# Altium project FMC-320U-A2.PrjPcb
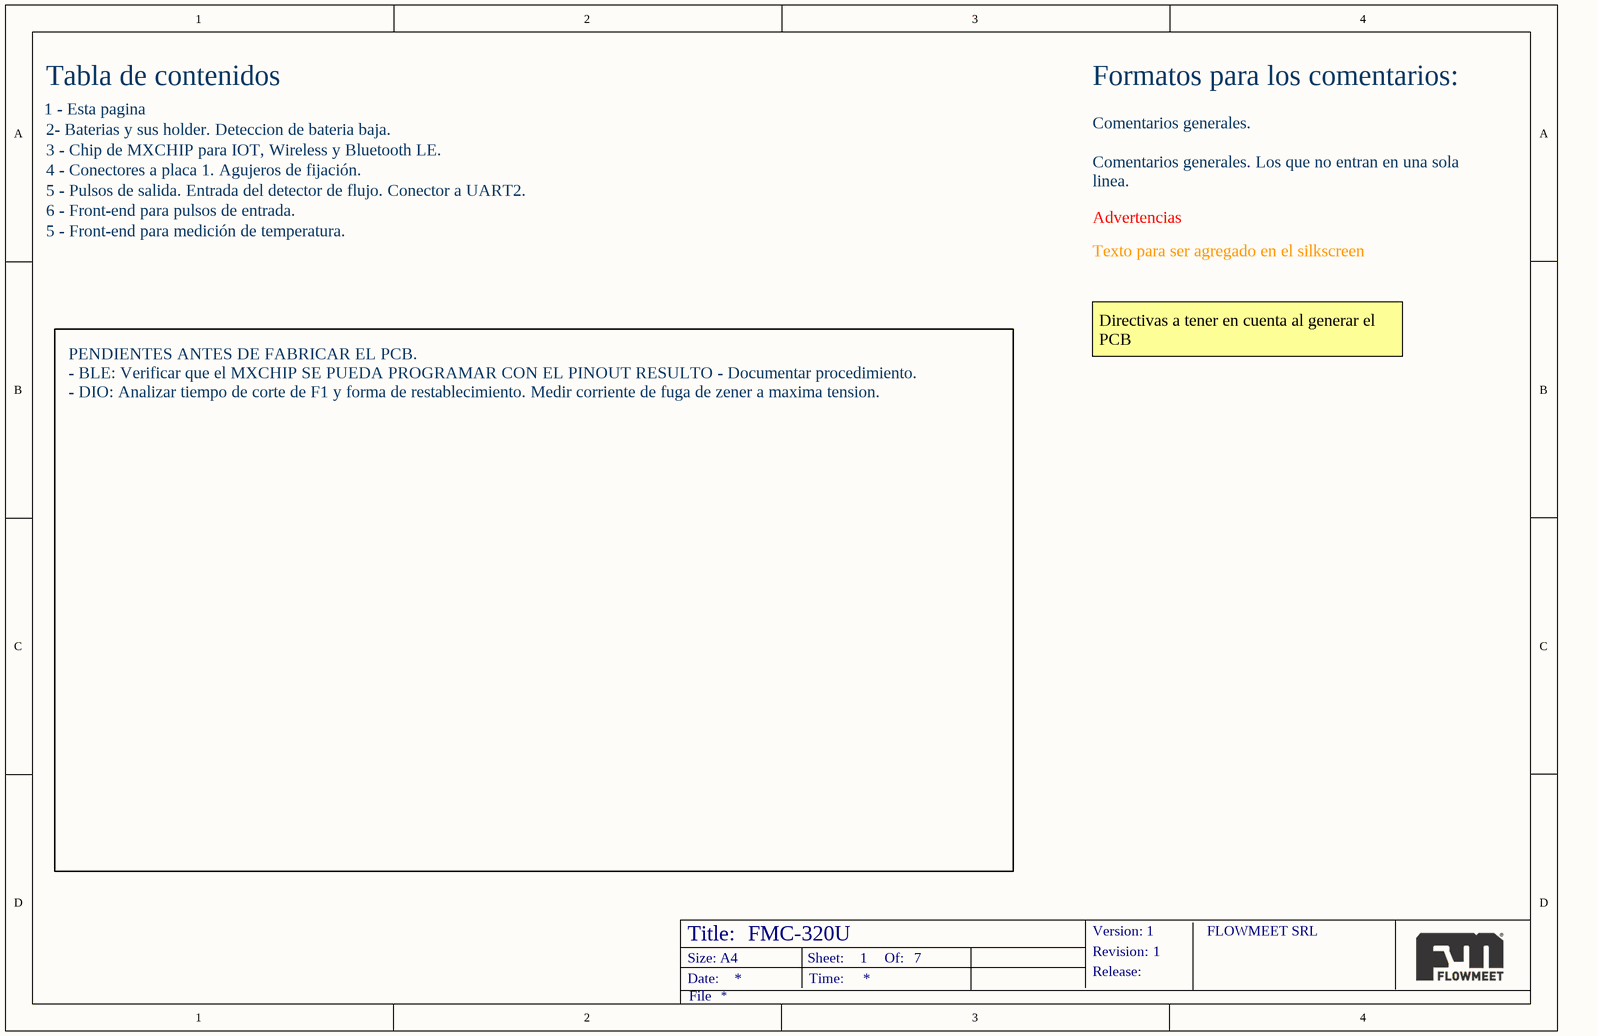
[diagram p0: READ_2.SchDoc]
7 sheets, 84 parts. Net scope: flat (ports and power ports of the same name join across sheets).
Board file: FMC-320U-A2.PcbDoc
Sheets:
  READ_2.SchDoc
  BATTERY.SchDoc
  BLE.SchDoc
  CON2.SchDoc
  DIO.SchDoc
  PULSE.SchDoc
  RTD.SchDoc

## Sheet READ_2.SchDoc: FMC-320U
size A4; Author: DHS; SheetNumber: 1; SheetTotal: 7; thisVersion: 1; ThisRevision: 1; Release: 1

### Notes on the sheet
- 1 - Esta pagina
- Tabla de contenidos
- Formatos para los comentarios:
- 2- Baterias y sus holder. Deteccion de bateria baja.
- 3 - Chip de MXCHIP para IOT, Wireless y Bluetooth LE.
- 4 - Conectores a placa 1. Agujeros de fijación.
- Comentarios generales.
- 5 - Pulsos de salida. Entrada del detector de flujo. Conector a UART2.
- 6 - Front-end para pulsos de entrada.
- 5 - Front-end para medición de temperatura.
- Advertencias
- Comentarios generales. Los que no entran en una sola linea.
- Texto para ser agregado en el silkscreen
- Directivas a tener en cuenta al generar el PCB
- PENDIENTES ANTES DE FABRICAR EL PCB.
  - BLE: Verificar que el MXCHIP SE PUEDA PROGRAMAR CON EL PINOUT RESULTO - Documentar procedimiento.
  - DIO: Analizar tiempo de corte de F1 y forma de restablecimiento. Medir corriente de fuga de zener a maxima tension.
- Title:
- Size: A4
- Date:
- Sheet:
- Time:
- Of:
- Version:
- Revision:
- Release:
- FLOWMEET SRL
- File

## Sheet BATTERY.SchDoc
size A4
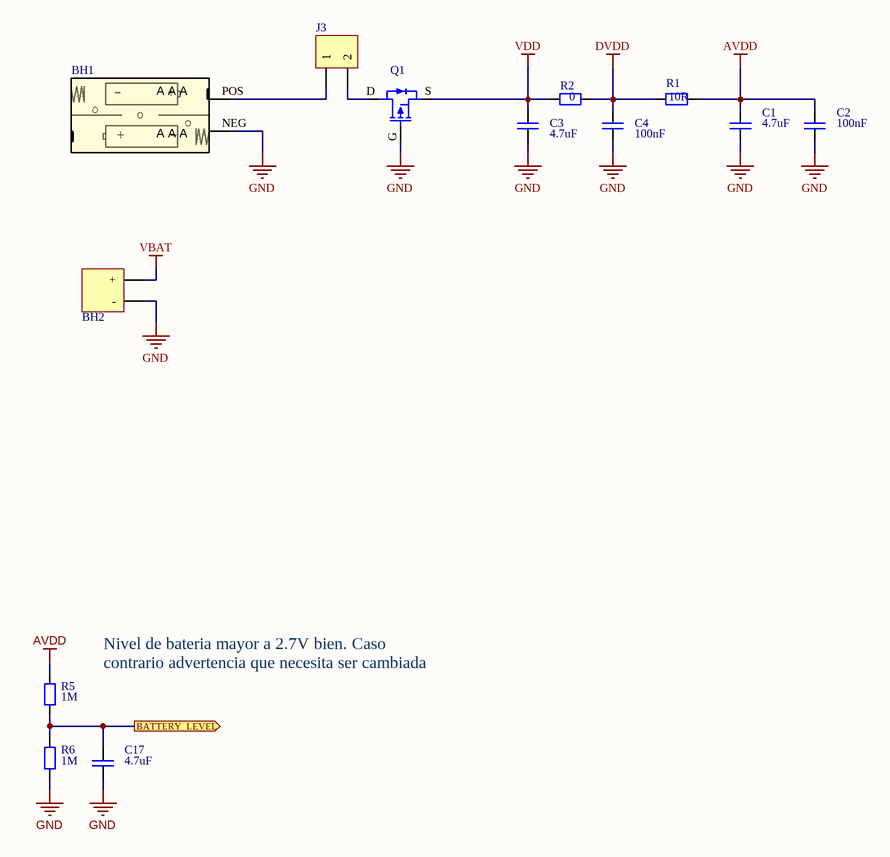
[diagram p1: BATTERY.SchDoc]

### Parts
BH1  2468  [BATTERY_HOLDER_2XAAA]  (value not drawn)
BH2  Battery Holder CR2032  [BS-08-B2AA016]  (value not drawn)
C1  4.7uF  [CAP_SM0805_YAGEOCC2_N]
C2  100nF  [CAP_SM0805_YAGEOCC2_N]
C3  4.7uF  [CAP_SM0805_YAGEOCC2_N]
C4  100nF  [CAP_SM0805_YAGEOCC2_N]
C17  4.7uF  [CAP_SM0805_YAGEOCC2_N]
J3  Usar Equivalente  [HEADER PIN 1X2]  (value not drawn)
Q1  DMG3401LSN-7  [DMG3401LSN-7]  (value not drawn)
R1  10R  [RES_SM0805_YAGEORC_N]
R2  0  [RES_SM0805_YAGEORC_N]
R5  1M  [RES_SM0805_YAGEORC_N]
R6  1M  [RES_SM0805_YAGEORC_N]

### Ports
BATTERY_LEVEL (out)

### Nets
AVDD: C1.1 C2.1 R1.2 R5.2
DVDD: C4.1 R1.1 R2.2
GND: BH1.NEG BH2.NEG(-) C1.2 C2.2 C3.2 C4.2 C17.2 Q1.G R6.1
VBAT: BH2.POS(+)
VDD: C3.1 Q1.S R2.1
BATTERY_LEVEL: C17.1 R5.1 R6.2 ; port BATTERY_LEVEL
NetBH1_POS: BH1.POS J3.1
NetJ3_2: J3.2 Q1.D

### Notes on the sheet
- Nivel de bateria mayor a 2.7V bien. Caso contrario advertencia que necesita ser cambiada
- Title:
- Size: A4
- Date:
- FMC-320U MODEL A
- Sheet:
- Time:
- Of:
- Version:
- Revision:
- Release:
- 1
- 0
- FLOWMEET SRL
- File
- (in symbol 2468) A A A; +; -

### Library data of the parts
BH1 = 2468: 2 x AAA through hole economic type; Manufacturer: Keystone Electronics; ComponentLink1Description: datasheet; ComponentLink1URL: https://www.keyelco.com/userAssets/file/M65p28.pdf; Manufacturer Part Number: 2468; Category: Battery holder
BH2 = BS-08-B2AA016: Battery base -25℃~+85℃ CR2032 SMD Battery Connectors ROHS /; Manufacturer: Myoung; Manufacturer part number: BS-08-B2AA016; Category: Battery holder; Datasheet: https://datasheet.lcsc.com/lcsc/2012181809_MYOUNG-BS-08-B2AA016_C964792.pdf
C1 C3 C17 = CC0805KRX5R6BB475: CAP 4.7uF SM0805 X5R 10V YAGEO CC2; Tolerance (%): 10; Category: Capacitor; Manufacturer: Yageo; Manufacturer Part Number: CC0805KRX5R6BB475; Package: 0805; Value: 4.7uF; Supplier Part Number 1: 718671; Supplier 1: Farnell; ComponentLink1URL: http://www.yageo.com; ComponentLink1Description: Manufacturer Website; Voltage Rating (Volts): 10; Supplier 2: Digi-Key; Supplier Part Number 2: 311-1374-1-ND; Datasheet: https://datasheet.lcsc.com/lcsc/2304140030_YAGEO-CC0805KRX5R6BB475_C605218.pdf
C2 C4 = CC0805KRX7R8BB104: CAP 100nF SM0805 X7R 25V YAGEO CC2; Tolerance (%): 10; Voltage Rating (Volts): 25; Category: Capacitor; Manufacturer: Yageo; Manufacturer Part Number: CC0805KRX7R8BB104; Package: 0805; Value: 100nF; Supplier Part Number 1: 644249; Supplier 1: Farnell; ComponentLink1URL: http://www.yageo.com; ComponentLink1Description: Manufacturer Website; Supplier 2: Digi-Key; Supplier Part Number 2: 311-1141-1-ND
J3 = 54101-T0602LF: 1 x 2 - true hole  2.54mm - Pb free; Manufacturer: Amphenol ICC; Equivalente: B-2100S02P-A110; Manufacturer Part Number: 54101-T0602LF; Category: Header pin; Datasheet: https://datasheet.lcsc.com/lcsc/2202082130_Amphenol-ICC-54101-T06-00_C213463.pdf
Q1 = DMG3401LSN-7: P-CHANNEL ENHANCEMENT MODE MOSFET / RDS(ON) = 85mΩ @ VGS = -2.5V -> ID -2.7A / V(BR)DDS 30V; Manufacturer: Diodes Incorporated; Category: Transistor mosfet; Manufacturer Part Number: DMG3401LSN-7; Datasheet: https://www.digikey.com/es/products/detail/diodes-incorporated/DMG3401LSN-7/3720138?s=N4IgTCBcDaICIFkDiBmALABgIwBkDKAcgLQDsIAugL5A
R1 = RC0805FR-0710RL: RES 10R SM0805 YAGEO RC_L; Power (Watts): 0.125; Resistance (Ohms): 10; Tolerance (%): 1; Category: Resistor; Manufacturer: Yageo; Manufacturer Part Number: RC0805FR-0710RL; Package: 0805; Value: 10R; Supplier Part Number 1: 9237240; Supplier 1: Farnell; ComponentLink1Description: Manufacturer Website; ComponentLink1URL: http://www.yageo.com; Supplier 2: Digi-Key; Supplier Part Number 2: 311-10.0CRCT-ND
R2 = RC0805JR-070RL: RES 0 OHMS SM0805 YAGEO RC_L; Manufacturer Part Number: RC0603FR-070RL; Power (Watts): 0.1; Tolerance (%): 1; Category: Resistor; Manufacturer: Yageo; Package: 0805; Resistance (Ohms): 0; Value: 0; ComponentLink1URL: http://www.yageo.com; ComponentLink1Description: Manufacturer Website; Supplier: LCSC
R5 R6 = RC0805FR-071ML: RES 1M SM0805 YAGEO RC_L; Power (Watts): 0.125; Resistance (Ohms): 1000000; Tolerance (%): 1; Category: Resistor; Manufacturer: Yageo; Manufacturer Part Number: RC0805FR-071ML; Package: 0805; Value: 1M; Supplier Part Number 1: 9237992; Supplier 1: Farnell; ComponentLink1URL: http://www.yageo.com; ComponentLink1Description: Manufacturer Website; Supplier 2: Digi-Key; Supplier Part Number 2: 311-1.00MCRCT-ND

## Sheet BLE.SchDoc
size A4
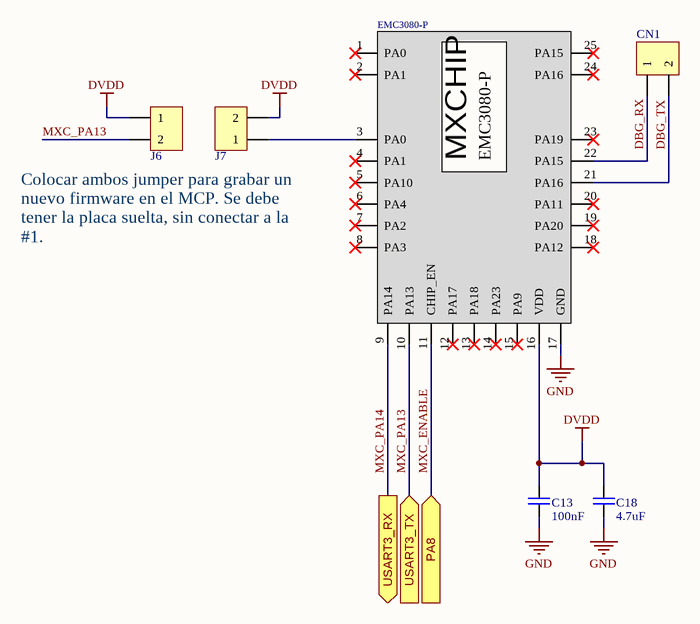
[diagram p2: BLE.SchDoc]

### Parts
C13  100nF  [CAP_SM0805_YAGEOCC2_N]
C18  4.7uF  [CAP_SM0805_YAGEOCC2_N]
CN1  Usar Equivalente  [HEADER PIN 1X2]  (value not drawn)
EMC3080-P  EMC3080-P  [EMC3080-P]  (value not drawn)
J6  Usar Equivalente  [HEADER PIN 1X2]  (value not drawn)
J7  Usar Equivalente  [HEADER PIN 1X2]  (value not drawn)

### Ports
PA8 (in), USART3_RX (out), USART3_TX (in)

### Nets
DVDD: C13.1 C18.1 EMC3080-P.16(VDD) J6.1 J7.2
GND: C13.2 C18.2 EMC3080-P.17(GND)
DBG_RX: CN1.1 EMC3080-P.22(PA15)
DBG_TX: CN1.2 EMC3080-P.21(PA16)
MXC_ENABLE: EMC3080-P.11(CHIP_EN) ; port PA8
MXC_PA13: EMC3080-P.10(PA13) J6.2 ; port USART3_TX
MXC_PA14: EMC3080-P.9(PA14) ; port USART3_RX
NetEMC3080-P_3: EMC3080-P.3(PA0) J7.1

Not connected (* = marked no-connect by the designer): EMC3080-P 1(PA0)* 2(PA1)* 4(PA1)* 5(PA10)* 6(PA4)* 7(PA2)* 8(PA3)* 12(PA17)* 13(PA18)* 14(PA23)* 15(PA9)* 18(PA12)* 19(PA20)* 20(PA11)* 23(PA19)* 24(PA16)* 25(PA15)*

### Notes on the sheet
- Colocar ambos jumper para grabar un nuevo firmware en el MCP. Se debe tener la placa suelta, sin conectar a la #1.
- Title:
- Size: A4
- Date:
- FMC-320U MODEL A
- Sheet:
- Time:
- Of:
- Version:
- Revision:
- Release:
- 1
- 0
- FLOWMEET SRL
- File

### Library data of the parts
C13 = CC0805KRX7R8BB104: as C2 on sheet BATTERY; Category: Capacitor; Manufacturer: Yageo; Manufacturer Part Number: CC0805KRX7R8BB104; Package: 0805; Value: 100nF; Supplier Part Number 1: 644249; Supplier 1: Farnell; ComponentLink1URL: http://www.yageo.com; ComponentLink1Description: Manufacturer Website; Supplier 2: Digi-Key; Supplier Part Number 2: 311-1141-1-ND
C18 = CC0805KRX5R6BB475: as C1 on sheet BATTERY; Category: Capacitor; Manufacturer: Yageo; Manufacturer Part Number: CC0805KRX5R6BB475; Package: 0805; Value: 4.7uF; Supplier Part Number 1: 718671; Supplier 1: Farnell; ComponentLink1URL: http://www.yageo.com; ComponentLink1Description: Manufacturer Website; Voltage Rating (Volts): 10; Supplier 2: Digi-Key; Supplier Part Number 2: 311-1374-1-ND; Datasheet: https://datasheet.lcsc.com/lcsc/2304140030_YAGEO-CC0805KRX5R6BB475_C605218.pdf
CN1 J6 J7 = 54101-T0602LF: as J3 on sheet BATTERY; Manufacturer Part Number: 54101-T0602LF; Category: Header pin; Datasheet: https://datasheet.lcsc.com/lcsc/2202082130_Amphenol-ICC-54101-T06-00_C213463.pdf
EMC3080-P = EMC3080-P: Solamente es el zocalo donde va montado el chip, por eso no tiene modelo 3D; Manufacturer: MXCHIP; Manufacturer Part Number: EMC3080-P; Category: BLE Module; Datasheet: https://files.seeedstudio.com/products/113990975/EMC3080EN.pdf

## Sheet CON2.SchDoc
size A4
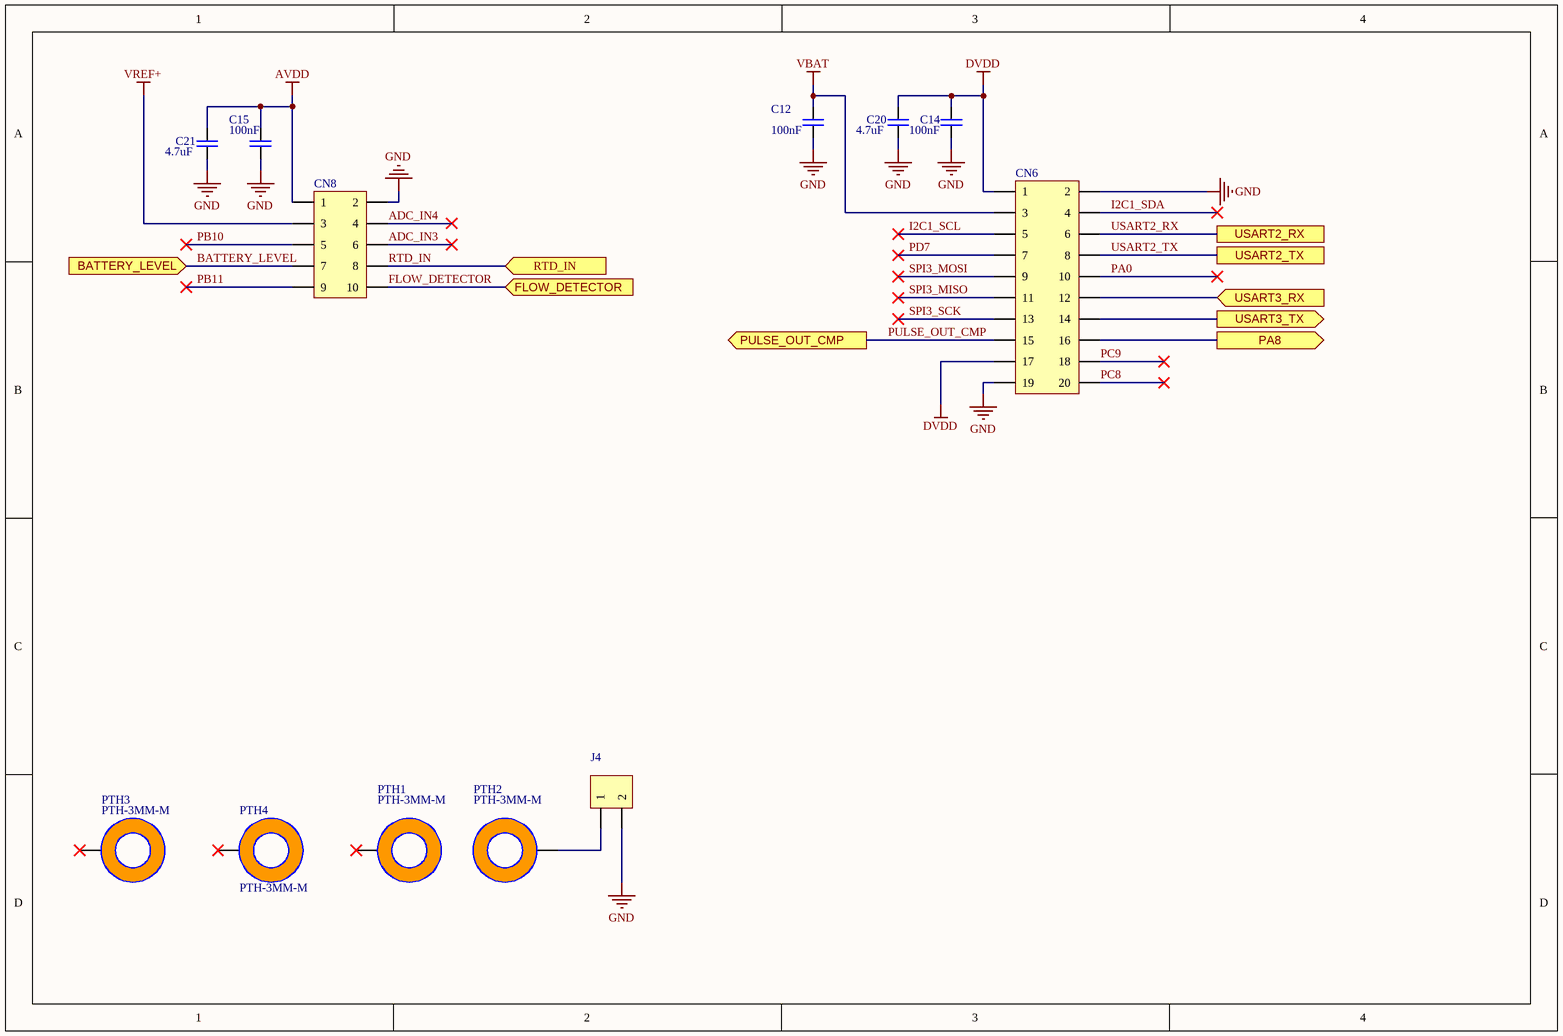
[diagram p3: CON2.SchDoc]

### Parts
C12  100nF  [CAP_SM0805_YAGEOCC2_N]
C14  100nF  [CAP_SM0805_YAGEOCC2_N]
C15  100nF  [CAP_SM0805_YAGEOCC2_N]
C20  4.7uF  [CAP_SM0805_YAGEOCC2_N]
C21  4.7uF  [CAP_SM0805_YAGEOCC2_N]
CN6  DZ254R-22-20-63  [HEADER PIN 2X10]  (value not drawn)
CN8  Uar Equivalente  [HEADER PIN 2X5 MIRROR]  (value not drawn)
J4  Usar Equivalene  [HEADER PIN 1X2]  (value not drawn)
PTH1  PTH-3MM-M  [PTH_M3_M]
PTH2  PTH-3MM-M  [PTH_M3_M]
PTH3  PTH-3MM-M  [PTH_M3_M]
PTH4  PTH-3MM-M  [PTH_M3_M]

### Ports
BATTERY_LEVEL (in), FLOW_DETECTOR (in), PA8 (out), PULSE_OUT_CMP (out), RTD_IN (in), USART2_RX, USART2_TX, USART3_RX (in), USART3_TX (out)

### Nets
AVDD: C15.1 C21.1 CN8.1
DVDD: C14.1 C20.1 CN6.1 CN6.17
GND: C12.2 C14.2 C15.2 C20.2 C21.2 CN6.2 CN6.19 CN8.2 J4.2
VBAT: C12.1 CN6.3
VREF+: CN8.3
ADC_IN3: CN8.6
ADC_IN4: CN8.4
BATTERY_LEVEL: CN8.7 ; port BATTERY_LEVEL
FLOW_DETECTOR: CN8.10 ; port FLOW_DETECTOR
I2C1_SCL: CN6.5
I2C1_SDA: CN6.4
MXC_ENABLE: CN6.16 ; port PA8
MXC_PA13: CN6.14 ; port USART3_TX
MXC_PA14: CN6.12 ; port USART3_RX
PA0: CN6.10
PB10: CN8.5
PB11: CN8.9
PC8: CN6.20
PC9: CN6.18
PD7: CN6.7
PULSE_OUT_CMP: CN6.15 ; port PULSE_OUT_CMP
RTD_IN: CN8.8 ; port RTD_IN
SPI3_MISO: CN6.11
SPI3_MOSI: CN6.9
SPI3_SCK: CN6.13
USART2_RX: CN6.6 ; port USART2_RX
USART2_TX: CN6.8 ; port USART2_TX
NetJ4_1: J4.1 PTH2.1

Not connected (* = marked no-connect by the designer): PTH1 1*; PTH3 1*; PTH4 1*

### Library data of the parts
C12 C14 C15 = CC0805KRX7R8BB104: as C2 on sheet BATTERY; Category: Capacitor; Manufacturer: Yageo; Manufacturer Part Number: CC0805KRX7R8BB104; Package: 0805; Value: 100nF; Supplier Part Number 1: 644249; Supplier 1: Farnell; ComponentLink1URL: http://www.yageo.com; ComponentLink1Description: Manufacturer Website; Supplier 2: Digi-Key; Supplier Part Number 2: 311-1141-1-ND
C20 C21 = CC0805KRX5R6BB475: as C1 on sheet BATTERY; Category: Capacitor; Manufacturer: Yageo; Manufacturer Part Number: CC0805KRX5R6BB475; Package: 0805; Value: 4.7uF; Supplier Part Number 1: 718671; Supplier 1: Farnell; ComponentLink1URL: http://www.yageo.com; ComponentLink1Description: Manufacturer Website; Voltage Rating (Volts): 10; Supplier 2: Digi-Key; Supplier Part Number 2: 311-1374-1-ND; Datasheet: https://datasheet.lcsc.com/lcsc/2304140030_YAGEO-CC0805KRX5R6BB475_C605218.pdf
CN6 = DZ254R-22-20-63: 2 x 10 - true hole 2.54mm; Manufacturer: DEALON; ComponentLink1Description: Datasheet; ComponentLink1URL: https://datasheet.lcsc.com/lcsc/2201121730_DEALON-DZ254R-22-20-63_C2935926.pdf; Manufacturer Part Number: DZ254R-22-20-63; Category: Header pin
CN8 = DZ254R-22-10-63: 2 x 5 - true hole 2.54mm; Manufacturer: DEALON; Equivalente: PZ254V-12-10P; Category: Header pin; Datasheet: https://datasheet.lcsc.com/lcsc/2201121730_DEALON-DZ254R-22-10-63_C2935920.pdf; Manufacturer Part Number: DZ254R-22-10-63
J4 = 54101-T0602LF: as J3 on sheet BATTERY; Manufacturer Part Number: 54101-T0602LF; Category: Header pin; Datasheet: https://datasheet.lcsc.com/lcsc/2202082130_Amphenol-ICC-54101-T06-00_C213463.pdf
PTH1-PTH4 = PTH-3MM-M: Agujero de montaje metalizado roscas M3. Drill de tamaño medio.

## Sheet DIO.SchDoc
size A4
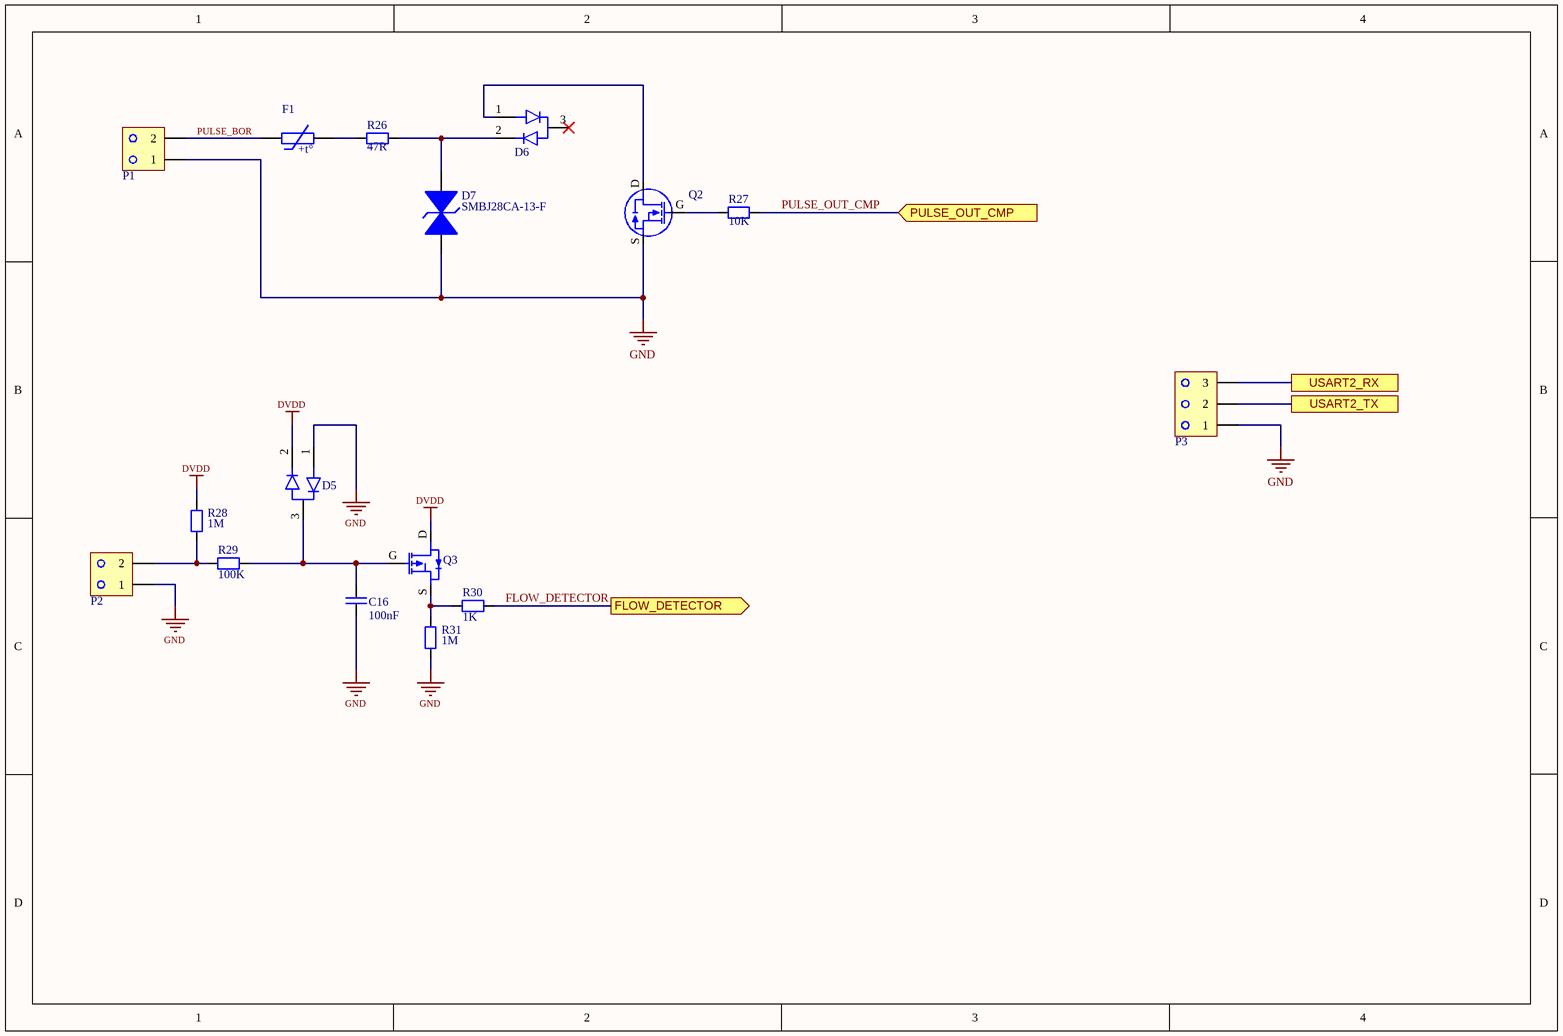
[diagram p4: DIO.SchDoc]

### Parts
C16  100nF  [CAP_SM0805_YAGEOCC2_N]
D5  BAV23S  [BAV23S]  (value not drawn)
D6  BAV23S  [BAV23S]  (value not drawn)
D7  SMBJ28CA-13-F  [SMBJ28CA-13-F]
F1  0ZCJ0005FF2E  [0ZCJ0005FF2E]  (value not drawn)
P1  WJ15EDGVC-3.81-2P  [HEADER PLUG 2]  (value not drawn)
P2  WJ15EDGVC-3.81-2P  [HEADER PLUG 2]  (value not drawn)
P3  WJ15EDGVC-3.81-3P  [HEADER PLUG 3]  (value not drawn)
Q2  DMG3402L-7  [DMG3402L-7]  (value not drawn)
Q3  DMG3401LSN-7  [DMG3401LSN-7]  (value not drawn)
R26  47R  [RES_SM0805_YAGEORC_N]
R27  10K  [RES_SM0805_YAGEORC_N]
R28  1M  [RES_SM0805_YAGEORC_N]
R29  100K  [RES_SM0805_YAGEORC_N]
R30  1K  [RES_SM0805_YAGEORC_N]
R31  1M  [RES_SM0805_YAGEORC_N]

### Ports
FLOW_DETECTOR (out), PULSE_OUT_CMP (in), USART2_RX, USART2_TX

### Nets
DVDD: D5.2 Q3.D R28.2
GND: C16.2 D5.1 D7.A P1.1 P2.1 P3.1 Q2.S R31.1
FLOW_DETECTOR: R30.2 ; port FLOW_DETECTOR
PULSE_BOR: F1.1 P1.2
PULSE_OUT_CMP: R27.1 ; port PULSE_OUT_CMP
USART2_RX: P3.3 ; port USART2_RX
USART2_TX: P3.2 ; port USART2_TX
NetC16_1: C16.1 D5.3 Q3.G R29.2
NetD6_1: D6.1 Q2.D
NetD6_2: D6.2 D7.K R26.1
NetF1_2: F1.2 R26.2
NetP2_2: P2.2 R28.1 R29.1
NetQ2_G: Q2.G R27.2
NetQ3_S: Q3.S R30.1 R31.2

Not connected (* = marked no-connect by the designer): D6 3*

### Notes on the sheet
- (in symbol 0ZCJ0005FF2E) +t°

### Library data of the parts
C16 = CC0805KRX7R8BB104: as C2 on sheet BATTERY; Category: Capacitor; Manufacturer: Yageo; Manufacturer Part Number: CC0805KRX7R8BB104; Package: 0805; Value: 100nF; Supplier Part Number 1: 644249; Supplier 1: Farnell; ComponentLink1URL: http://www.yageo.com; ComponentLink1Description: Manufacturer Website; Supplier 2: Digi-Key; Supplier Part Number 2: 311-1141-1-ND
D5 D6 = BAV23S: DIODE ARRAY GP 250V 200MA SOT23; Manufacturer: onsemi; Manufacturer Part Number: BAV23S; Category: Diodo; Datasheet: https://www.onsemi.com/pdf/datasheet/bav23s-d.pdf
D7 = SMBJ28CA-13-F: Manufacturer: Diodes Incorporated; Manufacturer Part Number: SMBJ24CA; Value: 24V - 26.7V - 38.9V; ComponentLink1Description: datasheet; ComponentLink1URL: https://datasheet.lcsc.com/lcsc/2304140030_Diodes-Incorporated-SMBJ28CA-13-F_C135064.pdf; Category: Diodo
F1 = 0ZCJ0005FF2E: PTC RESET FUSE 60V 50MA 1206; Manufacturer: Bel Fuse Inc.; Manufacturer Part Number: 0ZCJ0005FF2E; ComponentLink1Description: datasheet; ComponentLink1URL: https://www.belfuse.com/resources/datasheets/circuitprotection/ds-cp-0zcj-series.pdf; Category: Fusible
P1 P2 = WJ15EDGVC-3.81-2P: TERM BLOK FEMALE 1X2 3.81MM; Manufacturer: Ningbo Kangnex Elec; Manufacturer Part Number: WJ15EDGVC-3.81-2P; Category: Bornera enchufable; Datasheet: https://datasheet.lcsc.com/lcsc/1912251633_Ningbo-Kangnex-Elec-WJ15EDGVC-3-81-2P_C8396.pdf
P3 = WJ15EDGVC-3.81-3P: TERM BLOK FEMALE 1X3 3.81MM; Manufacturer: Ningbo Kangnex Elec; Category: Bornera enchufable; Manufacturer Part Number: WJ15EDGVC-3.81-3P; Datasheet: https://datasheet.lcsc.com/lcsc/1912251632_Ningbo-Kangnex-Elec-WJ15EDGVC-3-81-3P_C8389.pdf
Q2 = DMG3402L-7: N-CHANNEL ENHANCEMENT MODE FIELD EFFECT TRANSISTOR / 85mΩ @ VGS = 2.5V -> ID 2A / V(BR)DDS 30V /; Manufacturer: Diodes Incorporated; Category: Transistor mosfet; Manufacturer Part Number: DMG3402L-7; Datasheet: https://www.diodes.com/assets/Datasheets/DMG3402L.pdf
Q3 = DMG3401LSN-7: as Q1 on sheet BATTERY; Category: Transistor mosfet; Manufacturer Part Number: DMG3401LSN-7; Datasheet: https://www.digikey.com/es/products/detail/diodes-incorporated/DMG3401LSN-7/3720138?s=N4IgTCBcDaICIFkDiBmALABgIwBkDKAcgLQDsIAugL5A
R26 = RC0805FR-0747RL: RES 47R SM0805 YAGEO RC_L; Power (Watts): 0.125; Resistance (Ohms): 47; Tolerance (%): 1; Category: Resistor; Manufacturer: Yageo; Manufacturer Part Number: RC0805FR-0747RL; Package: 0805; Value: 47R; Supplier Part Number 1: 9237321; Supplier 1: Farnell; ComponentLink1Description: Manufacturer Website; ComponentLink1URL: http://www.yageo.com; Supplier 2: Digi-Key; Supplier Part Number 2: 311-47.0CRCT-ND
R27 = RC0805FR-0710KL: RES 10K SM0805 YAGEO RC_L; Power (Watts): 0.125; Resistance (Ohms): 10000; Tolerance (%): 1; Category: Resistor; Manufacturer: Yageo; Manufacturer Part Number: RC0805FR-0710KL; Package: 0805; Value: 10K; Supplier Part Number 1: 9237755; Supplier 1: Farnell; ComponentLink1Description: Manufacturer Website; ComponentLink1URL: http://www.yageo.com; Supplier 2: Digi-Key; Supplier Part Number 2: 311-10.0KCRCT-ND
R28 R31 = RC0805FR-071ML: as R5 on sheet BATTERY; Category: Resistor; Manufacturer: Yageo; Manufacturer Part Number: RC0805FR-071ML; Package: 0805; Value: 1M; Supplier Part Number 1: 9237992; Supplier 1: Farnell; ComponentLink1URL: http://www.yageo.com; ComponentLink1Description: Manufacturer Website; Supplier 2: Digi-Key; Supplier Part Number 2: 311-1.00MCRCT-ND
R29 = RC0805FR-07100KL: RES 100K SM0805 YAGEO RC_L; Power (Watts): 0.125; Resistance (Ohms): 100000; Tolerance (%): 1; Category: Resistor; Manufacturer: Yageo; Manufacturer Part Number: RC0805FR-07100KL; Package: 0805; Value: 100K; Supplier Part Number 1: 9237879; Supplier 1: Farnell; ComponentLink1Description: Manufacturer Website; ComponentLink1URL: http://www.yageo.com; Supplier 2: Digi-Key; Supplier Part Number 2: 311-100KCRCT-ND
R30 = RC0805FR-071KL: RES 1K SM0805 YAGEO RC_L; Power (Watts): 0.125; Resistance (Ohms): 1000; Tolerance (%): 1; Category: Resistor; Manufacturer: Yageo; Manufacturer Part Number: RC0805FR-071KL; Package: 0805; Value: 1K; Supplier Part Number 1: 9237496; Supplier 1: Farnell; ComponentLink1URL: http://www.yageo.com; ComponentLink1Description: Manufacturer Website; Supplier 2: Digi-Key; Supplier Part Number 2: 311-1.00KCRCT-ND

## Sheet PULSE.SchDoc
size A4
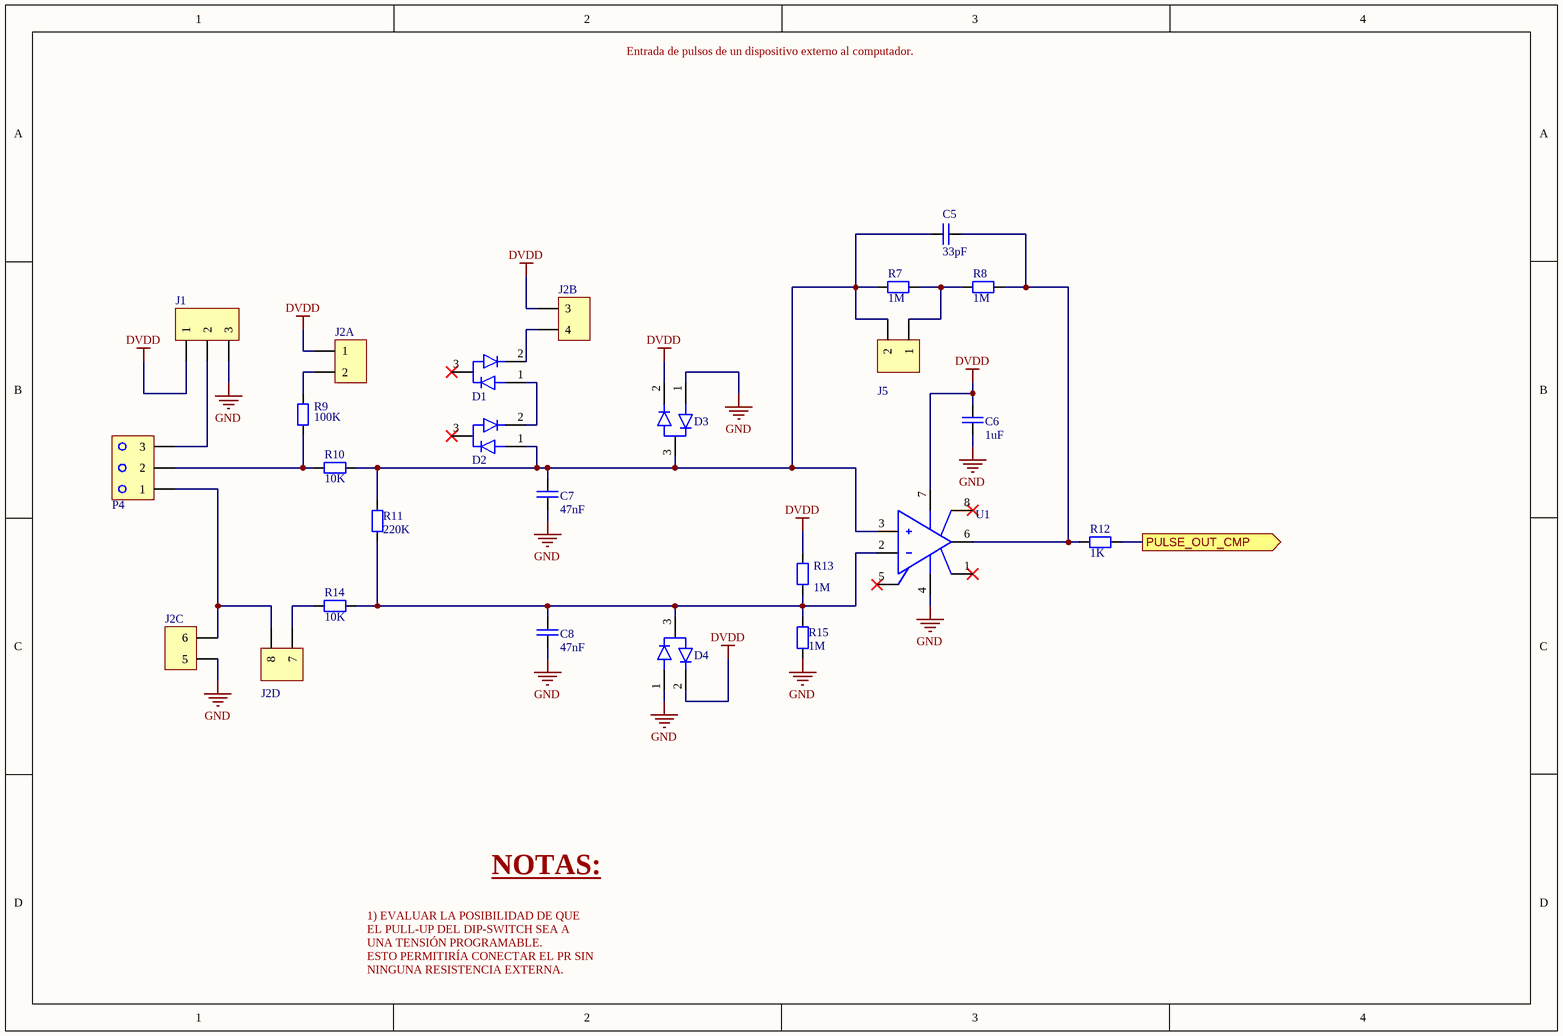
[diagram p5: PULSE.SchDoc]

### Parts
C5  33pF  [CAP_SM0805_YAGEOCC2_N]
C6  1uF  [CAP_SM0805_YAGEOCC2_N]
C7  47nF  [CAP_SM0805_YAGEOCC2_N]
C8  47nF  [CAP_SM0805_YAGEOCC2_N]
D1  BAV23S  [BAV23S]  (value not drawn)
D2  BAV23S  [BAV23S]  (value not drawn)
D3  BAV23S  [BAV23S]  (value not drawn)
D4  BAV23S  [BAV23S]  (value not drawn)
J1  (no value)  [HEADER PIN 1X3]
J2  Usar equivalente  [HEADER PIN 2X4]  (value not drawn)  (parts A,B,C,D of 4)
J5  Usar Equivalente  [HEADER PIN 1X2]  (value not drawn)
P4  WJ15EDGVC-3.81-3P  [HEADER PLUG 3]  (value not drawn)
R7  1M  [RES_SM0805_YAGEORC_N]
R8  1M  [RES_SM0805_YAGEORC_N]
R9  100K  [RES_SM0805_YAGEORC_N]
R10  10K  [RES_SM0805_YAGEORC_N]
R11  220K  [RES_SM0805_YAGEORC_N]
R12  1K  [RES_SM0805_YAGEORC_N]
R13  1M  [RES_SM0805_YAGEORC_N]
R14  10K  [RES_SM0805_YAGEORC_N]
R15  1M  [RES_SM0805_YAGEORC_N]
U1  MCP6541  [MCP6541-E/SN]  (value not drawn)

### Ports
PULSE_OUT_CMP (out)

### Nets
DVDD: C6.1 D3.2 D4.2 J1.1 J2.1 J2.3 R13.2 U1.7(V+)
GND: C6.2 C7.2 C8.2 D3.1 D4.1 J1.3 J2.5 R15.1 U1.4(V-)
PULSE_OUT_CMP: R12.2 ; port PULSE_OUT_CMP
NetC5_1: C5.1 C7.1 D2.1 D3.3 J5.2 R7.1 R10.2 R11.2 U1.3(IN+)
NetC5_2: C5.2 R8.2 R12.1 U1.6(OUT)
NetC8_1: C8.1 D4.3 R11.1 R13.1 R14.2 R15.2 U1.2(IN-)
NetD1_1: D1.1 D2.2
NetD1_2: D1.2 J2.4
NetJ1_2: J1.2 P4.3
NetJ2_2: J2.2 R9.2
NetJ2_6: J2.6 J2.8 P4.1
NetJ2_7: J2.7 R14.1
NetJ5_1: J5.1 R7.2 R8.1
NetP4_2: P4.2 R9.1 R10.1

Not connected (* = marked no-connect by the designer): D1 3*; D2 3*; U1 1(OS_NUL)* 5(OS_NUL)* 8(TAB)*

### Notes on the sheet
- Entrada de pulsos de un dispositivo externo al computador.
- NOTAS:
- 1) EVALUAR LA POSIBILIDAD DE QUE EL PULL-UP DEL DIP-SWITCH SEA A UNA TENSIÓN PROGRAMABLE.
  ESTO PERMITIRÍA CONECTAR EL PR SIN NINGUNA RESISTENCIA EXTERNA.
- Title:
- Size: A4
- Date:
- FMC-320U MODEL A
- Sheet:
- Time:
- Of:
- Version:
- Revision:
- Release:
- 1
- 0
- FLOWMEET SRL
- File

### Library data of the parts
C5 = CC0805JRNPO9BN330: CAP 33pF SM0805 NPO 50V YAGEO CC2; Tolerance (%): 5; Voltage Rating (Volts): 50; Category: Capacitor; Manufacturer: Yageo; Manufacturer Part Number: CC0805JRNPO9BN330; Package: 0805; Value: 33pF; Supplier Part Number 1: 1362559; Supplier 1: Farnell; ComponentLink1URL: http://www.yageo.com; ComponentLink1Description: Manufacturer Website; Supplier 2: Digi-Key; Supplier Part Number 2: 311-1105-1-ND
C6 = CC0805KKX7R8BB105: CAP 1uF SM0805 X7R 25V YAGEO CC2; Tolerance (%): 10; Voltage Rating (Volts): 25; Category: Capacitor; Manufacturer: Yageo; Manufacturer Part Number: CC0805KKX7R8BB105; Package: 0805; Value: 1uF; Supplier Part Number 1: 1458903; Supplier 1: Farnell; ComponentLink1URL: http://www.yageo.com; ComponentLink1Description: Manufacturer Website; Supplier 2: Digi-Key; Supplier Part Number 2: 311-1456-1-ND
C7 C8 = CC0805KRX7R8BB473: CAP 47nF SM0805 X7R 25V YAGEO CC2; Tolerance (%): 10; Voltage Rating (Volts): 25; Category: Capacitor; Manufacturer: Yageo; Manufacturer Part Number: CC0805KRX7R8BB473; Package: 0805; Value: 47nF; Supplier Part Number 1: 644201; Supplier 1: Farnell; ComponentLink1URL: http://www.yageo.com; ComponentLink1Description: Manufacturer Website; Supplier 2: Digi-Key
D1-D4 = BAV23S: as D5 on sheet DIO; Manufacturer Part Number: BAV23S; Category: Diodo; Datasheet: https://www.onsemi.com/pdf/datasheet/bav23s-d.pdf
J1 = 54101-T0600LF-03: 1 x 3 - Cuttable - true hole  2.54mm - Pb free; Manufacturer: Amphenol ICC; Manufacturer Part Number: 54101-T06-00; Type: Thru-hole; Package: 2.54mm; ComponentLink1Description: Datasheet; ComponentLink1URL: https://datasheet.lcsc.com/lcsc/2202082130_Amphenol-ICC-54101-T06-00_C213463.pdf
J2 = 54102-T0604LF-JUMPER: 2 x 4  - true hole  2.54mm; Manufacturer: Amphenol ICC; Equivalente: PZ254V-12-8P; Category: Header pin; Datasheet: New link; Manufacturer PartNumber: 54102-T0604LF
J5 = 54101-T0602LF: as J3 on sheet BATTERY; Manufacturer Part Number: 54101-T0602LF; Category: Header pin; Datasheet: https://datasheet.lcsc.com/lcsc/2202082130_Amphenol-ICC-54101-T06-00_C213463.pdf
P4 = WJ15EDGVC-3.81-3P: as P3 on sheet DIO; Category: Bornera enchufable; Manufacturer Part Number: WJ15EDGVC-3.81-3P; Datasheet: https://datasheet.lcsc.com/lcsc/1912251632_Ningbo-Kangnex-Elec-WJ15EDGVC-3-81-3P_C8389.pdf
R7 R8 R13 R15 = RC0805FR-071ML: as R5 on sheet BATTERY; Category: Resistor; Manufacturer: Yageo; Manufacturer Part Number: RC0805FR-071ML; Package: 0805; Value: 1M; Supplier Part Number 1: 9237992; Supplier 1: Farnell; ComponentLink1URL: http://www.yageo.com; ComponentLink1Description: Manufacturer Website; Supplier 2: Digi-Key; Supplier Part Number 2: 311-1.00MCRCT-ND
R9 = RC0805FR-07100KL: as R29 on sheet DIO; Category: Resistor; Manufacturer: Yageo; Manufacturer Part Number: RC0805FR-07100KL; Package: 0805; Value: 100K; Supplier Part Number 1: 9237879; Supplier 1: Farnell; ComponentLink1Description: Manufacturer Website; ComponentLink1URL: http://www.yageo.com; Supplier 2: Digi-Key; Supplier Part Number 2: 311-100KCRCT-ND
R10 R14 = RC0805FR-0710KL: as R27 on sheet DIO; Category: Resistor; Manufacturer: Yageo; Manufacturer Part Number: RC0805FR-0710KL; Package: 0805; Value: 10K; Supplier Part Number 1: 9237755; Supplier 1: Farnell; ComponentLink1Description: Manufacturer Website; ComponentLink1URL: http://www.yageo.com; Supplier 2: Digi-Key; Supplier Part Number 2: 311-10.0KCRCT-ND
R11 = RC0805FR-07220KL: RES 220K SM0805 YAGEO RC_L; Power (Watts): 0.125; Resistance (Ohms): 220000; Tolerance (%): 1; Category: Resistor; Manufacturer: Yageo; Manufacturer Part Number: RC0805FR-07220KL; Package: 0805; Value: 220K; Supplier Part Number 1: 9237917; Supplier 1: Farnell; ComponentLink1Description: Manufacturer Website; ComponentLink1URL: http://www.yageo.com; Supplier 2: Digi-Key; Supplier Part Number 2: 311-220KCRCT-ND
R12 = RC0805FR-071KL: as R30 on sheet DIO; Category: Resistor; Manufacturer: Yageo; Manufacturer Part Number: RC0805FR-071KL; Package: 0805; Value: 1K; Supplier Part Number 1: 9237496; Supplier 1: Farnell; ComponentLink1URL: http://www.yageo.com; ComponentLink1Description: Manufacturer Website; Supplier 2: Digi-Key; Supplier Part Number 2: 311-1.00KCRCT-ND
U1 = MCP6541-E/SN: IC COMP PP I/O SNGL 1.6V 8SOIC; Manufacturer: Microchip Tech; Manufacturer Part Number: MCP6541-E/SN; Category: Amplificador operacional; Datasheet: https://ww1.microchip.com/downloads/en/DeviceDoc/MCP6541%20Output%20SubMicroamp%20Comparators%2020001696K.pdf

## Sheet RTD.SchDoc
size A4
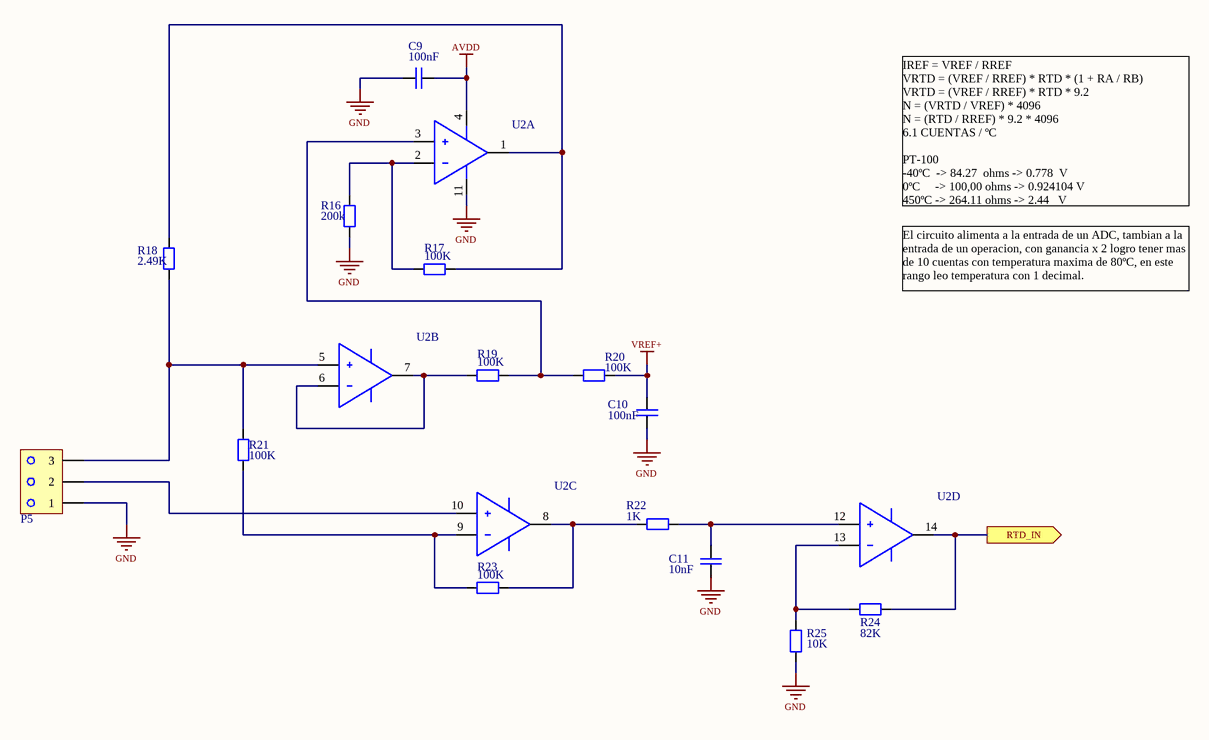
[diagram p6: RTD.SchDoc]

### Parts
C9  100nF  [CAP_SM0805_YAGEOCC2_N]
C10  100nF  [CAP_SM0805_YAGEOCC2_N]
C11  10nF  [CAP_SM0805_YAGEOCC2_N]
P5  WJ15EDGVC-3.81-3P  [HEADER PLUG 3]  (value not drawn)
R16  200k  [RES_SM0805_YAGEORC_N]
R17  100K  [RES_SM0805_YAGEORC_N]
R18  2.49K  [RES_SM0805_YAGEORC_N]
R19  100K  [RES_SM0805_YAGEORC_N]
R20  100K  [RES_SM0805_YAGEORC_N]
R21  100K  [RES_SM0805_YAGEORC_N]
R22  1K  [RES_SM0805_YAGEORC_N]
R23  100K  [RES_SM0805_YAGEORC_N]
R24  82K  [RES_SM0805_YAGEORC_N]
R25  10K  [RES_SM0805_YAGEORC_N]
U2  GS8044  [GS8044-SR]  (value not drawn)  (parts A,B,C,D of 4)

### Ports
RTD_IN (out)

### Nets
AVDD: C9.1 U2.4(VDD)
GND: C9.2 C10.2 C11.2 P5.1 R16.1 R25.1 U2.11(VSS)
VREF+: C10.1 R20.2
RTD_IN: R24.2 U2.14(VOUTD) ; port RTD_IN
NetC11_1: C11.1 R22.2 U2.12(VIND+)
NetP5_2: P5.2 U2.10(VINC+)
NetP5_3: P5.3 R18.1 R21.2 U2.5(VINB+)
NetR16_2: R16.2 R17.1 U2.2(VINA-)
NetR17_2: R17.2 R18.2 U2.1(VOUTA)
NetR19_1: R19.1 U2.6(VINB-) U2.7(VOUTB)
NetR19_2: R19.2 R20.1 U2.3(VINA+)
NetR21_1: R21.1 R23.1 U2.9(VINC-)
NetR22_1: R22.1 R23.2 U2.8(VOUTC)
NetR24_1: R24.1 R25.2 U2.13(VIND-)

### Notes on the sheet
- IREF = VREF / RREF
  VRTD = (VREF / RREF) * RTD * (1 + RA / RB)
  VRTD = (VREF / RREF) * RTD * 9.2
  N = (VRTD / VREF) * 4096
  N = (RTD / RREF) * 9.2 * 4096
  6.1 CUENTAS / ºC
  PT-100
  -40ºC  -> 84.27  ohms -> 0.778  V
  0ºC     -> 100,00 ohms -> 0.924104 V
  450ºC -> 264.11 ohms -> 2.44   V
- El circuito alimenta a la entrada de un ADC, tambian a la entrada de un operacion, con ganancia x 2 logro tener mas de 10 cuentas con temperatura maxima de 80ºC, en este rango leo temperatura con 1 decimal.
- Title:
- Size: A4
- Date:
- FMC-320U MODEL A
- Sheet:
- Time:
- Of:
- Version:
- Revision:
- Release:
- 1
- 0
- FLOWMEET SRL
- File

### Library data of the parts
C9 C10 = CC0805KRX7R8BB104: as C2 on sheet BATTERY; Category: Capacitor; Manufacturer: Yageo; Manufacturer Part Number: CC0805KRX7R8BB104; Package: 0805; Value: 100nF; Supplier Part Number 1: 644249; Supplier 1: Farnell; ComponentLink1URL: http://www.yageo.com; ComponentLink1Description: Manufacturer Website; Supplier 2: Digi-Key; Supplier Part Number 2: 311-1141-1-ND
C11 = CC0805KRX7R8BB103: CAP 10nF SM0805 X7R 25V YAGEO CC2; Tolerance (%): 10; Voltage Rating (Volts): 25; Category: Capacitor; Manufacturer: Yageo; Manufacturer Part Number: CC0805KRX7R8BB103; Package: 0805; Value: 10nF; Supplier Part Number 1: 3019767; Supplier 1: Farnell; ComponentLink1URL: http://www.yageo.com; ComponentLink1Description: Manufacturer Website
P5 = WJ15EDGVC-3.81-3P: as P3 on sheet DIO; Manufacturer Part Number: WJ15EDGVC-3.81-3P; Category: Bornera enchufable; Datasheet: https://datasheet.lcsc.com/lcsc/1912251632_Ningbo-Kangnex-Elec-WJ15EDGVC-3-81-3P_C8389.pdf
R16 = RC0805FR-07200KL: RES 200K SM0805 YAGEO RC_L; Power (Watts): 0.1; Resistance (Ohms): 200000; Tolerance (%): 1; Category: Resistor; Manufacturer: Yageo; Manufacturer Part Number: RC0805FR-07200KL; Package: 0805; Value: 200k; ComponentLink1URL: http://www.yageo.com; ComponentLink1Description: Manufacturer Website
R17 R19-R21 R23 = RC0805FR-07100KL: as R29 on sheet DIO; Category: Resistor; Manufacturer: Yageo; Manufacturer Part Number: RC0805FR-07100KL; Package: 0805; Value: 100K; Supplier Part Number 1: 9237879; Supplier 1: Farnell; ComponentLink1Description: Manufacturer Website; ComponentLink1URL: http://www.yageo.com; Supplier 2: Digi-Key; Supplier Part Number 2: 311-100KCRCT-ND
R18 = RT0805FRE072K49L: RES 2K49 SM0805 YAGEO RT_L; Manufacturer Part Number: RC0603FR-072K49L; Power (Watts): 0.1; Resistance (Ohms): 2490; Tolerance (%): 1; Category: Resistor; Manufacturer: Yageo; Package: 0805; Value: 2.49K; ComponentLink1URL: http://www.yageo.com; ComponentLink1Description: Manufacturer Website
R22 = RC0805FR-071KL: as R30 on sheet DIO; Category: Resistor; Manufacturer: Yageo; Manufacturer Part Number: RC0805FR-071KL; Package: 0805; Value: 1K; Supplier Part Number 1: 9237496; Supplier 1: Farnell; ComponentLink1URL: http://www.yageo.com; ComponentLink1Description: Manufacturer Website; Supplier 2: Digi-Key; Supplier Part Number 2: 311-1.00KCRCT-ND
R24 = RC0805FR-0782KL: RES 82K SM0805 YAGEO RC_L; Power (Watts): 0.125; Resistance (Ohms): 82000; Tolerance (%): 1; Category: Resistor; Manufacturer: Yageo; Manufacturer Part Number: RC0805FR-0782KL; Package: 0805; Value: 82K; Supplier Part Number 1: 9237860; Supplier 1: Farnell; ComponentLink1Description: Manufacturer Website; ComponentLink1URL: http://www.yageo.com; Supplier 2: Digi-Key; Supplier Part Number 2: 311-82.0KCRCT-ND
R25 = RC0805FR-0710KL: as R27 on sheet DIO; Category: Resistor; Manufacturer: Yageo; Manufacturer Part Number: RC0805FR-0710KL; Package: 0805; Value: 10K; Supplier Part Number 1: 9237755; Supplier 1: Farnell; ComponentLink1Description: Manufacturer Website; ComponentLink1URL: http://www.yageo.com; Supplier 2: Digi-Key; Supplier Part Number 2: 311-10.0KCRCT-ND
U2 = GS8044-SR: IC OPAMP GP 4 CIRCUIT 14SOIC; Manufacturer: Gainsil; Manufacturer Part Number: GS8044-SR; Category: Amplificador operacional; Datasheet: https://datasheet.lcsc.com/lcsc/2206101816_Gainsil-GS8044-SR_C605428.pdf

## Nets that join several sheets
AVDD: BATTERY (C1.1 C2.1 R1.2 R5.2), CON2 (C15.1 C21.1 CN8.1), RTD (C9.1 U2.4)
DVDD: BATTERY (C4.1 R1.1 R2.2), BLE (5 pins), CON2 (C14.1 C20.1 CN6.1 CN6.17), DIO (D5.2 Q3.D R28.2), PULSE (8 pins)
GND: BATTERY (9 pins), BLE (C13.2 C18.2 EMC3080-P.17), CON2 (9 pins), DIO (8 pins), PULSE (9 pins), RTD (7 pins)
VBAT: BATTERY (BH2.POS), CON2 (C12.1 CN6.3)
VREF+: CON2 (CN8.3), RTD (C10.1 R20.2)
BATTERY_LEVEL: BATTERY (C17.1 R5.1 R6.2), CON2 (CN8.7)
FLOW_DETECTOR: CON2 (CN8.10), DIO (R30.2)
MXC_ENABLE: BLE (EMC3080-P.11), CON2 (CN6.16)
MXC_PA13: BLE (EMC3080-P.10 J6.2), CON2 (CN6.14)
MXC_PA14: BLE (EMC3080-P.9), CON2 (CN6.12)
PULSE_OUT_CMP: CON2 (CN6.15), DIO (R27.1), PULSE (R12.2)
RTD_IN: CON2 (CN8.8), RTD (R24.2 U2.14)
USART2_RX: CON2 (CN6.6), DIO (P3.3)
USART2_TX: CON2 (CN6.8), DIO (P3.2)